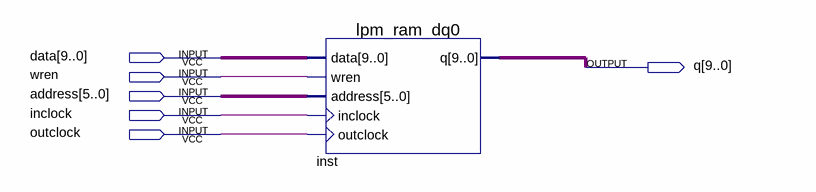
[diagram p0: schematic sheet]
// Quartus schematic lab10_3.bdf as structural Verilog: 1 symbols, 6 pins
module lab10_3 (
  input  [9:0] data,
  input  wren,
  input  [5:0] address,
  input  inclock,
  input  outclock,
  output [9:0] q
);

  lpm_ram_dq0 inst (.data(data), .wren(wren), .address(address), .inclock(inclock), .outclock(outclock), .q(q));
endmodule
